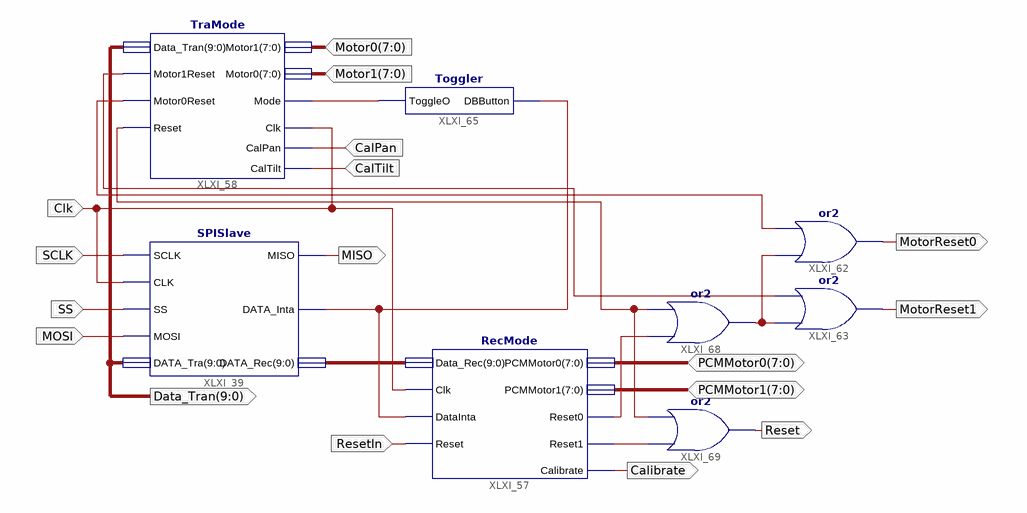
[diagram p0: schematic sheet 1]
// Xilinx ISE schematic Communication.sch (spartan3e) as structural Verilog: 8 symbols, 17 ports
module Communication (
  input  Clk,
  input  SCLK,
  input  SS,
  input  MOSI,
  input  [7:0] Motor0,
  input  [7:0] Motor1,
  input  CalPan,
  input  CalTilt,
  input  ResetIn,
  inout  [7:0] PCMMotor0,
  inout  [7:0] PCMMotor1,
  output MISO,
  output Calibrate,
  output [9:0] Data_Tran,
  output MotorReset0,
  output MotorReset1,
  output Reset
);

  wire XLXN_7, XLXN_15, XLXN_22, XLXN_34, XLXN_36, XLXN_37, XLXN_38, XLXN_42;
  wire [9:0] XLXN_5;

  RecMode XLXI_57 (
    .Clk(Clk), .DataInta(XLXN_7), .Data_Rec(XLXN_5), .PCMMotor0(PCMMotor0), .PCMMotor1(PCMMotor1),
    .Calibrate(Calibrate), .Reset0(XLXN_34), .Reset1(XLXN_42), .Reset(ResetIn));
  SPISlave XLXI_39 (
    .SCLK(SCLK), .CLK(Clk), .SS(SS), .MOSI(MOSI), .DATA_Tra(Data_Tran), .MISO(MISO), .DATA_Inta(XLXN_7),
    .DATA_Rec(XLXN_5));
  Toggler XLXI_65 (.DBButton(XLXN_7), .ToggleO(XLXN_15));
  TraMode XLXI_58 (
    .Clk(Clk), .CalPan(CalPan), .CalTilt(CalTilt), .Mode(XLXN_15), .Motor0(Motor1), .Motor1(Motor0),
    .Motor0Reset(XLXN_22), .Motor1Reset(XLXN_38), .Data_Tran(Data_Tran), .Reset(XLXN_37));
  or XLXI_68 (XLXN_36, XLXN_34, XLXN_37);
  or XLXI_62 (MotorReset0, XLXN_36, XLXN_22);
  or XLXI_63 (MotorReset1, XLXN_36, XLXN_38);
  or XLXI_69 (Reset, XLXN_42, XLXN_37);
endmodule
